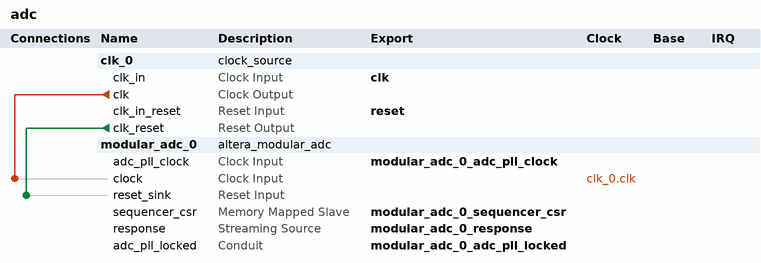
[diagram p0: system contents]
# Platform Designer (Qsys) system adc, MAX 10 10M50DAF484I7G
# Parameters at their usual value, and those the tool derives, are not listed.
package require -exact qsys 17.0
create_system adc
set_project_property DEVICE_FAMILY {MAX 10}
set_project_property DEVICE 10M50DAF484I7G

add_instance clk_0 clock_source 17.0
set_instance_parameter_value clk_0 clockFrequency 50000000
set_instance_parameter_value clk_0 resetSynchronousEdges BOTH

add_instance modular_adc_0 altera_modular_adc 17.0
set_instance_parameter_value modular_adc_0 CLOCK_FREQ 50000000
set_instance_parameter_value modular_adc_0 CORE_VAR 2
set_instance_parameter_value modular_adc_0 DEVICE_PART 10M50DAF484I7G
set_instance_parameter_value modular_adc_0 clkdiv 1
set_instance_parameter_value modular_adc_0 external_vref 2.0
set_instance_parameter_value modular_adc_0 int_vref_vr 3.0
set_instance_parameter_value modular_adc_0 refsel 1
set_instance_parameter_value modular_adc_0 sample_rate 5
set_instance_parameter_value modular_adc_0 seq_order_length 9
set_instance_parameter_value modular_adc_0 seq_order_slot_1 0
set_instance_parameter_value modular_adc_0 seq_order_slot_10 17
set_instance_parameter_value modular_adc_0 seq_order_slot_2 1
set_instance_parameter_value modular_adc_0 seq_order_slot_3 2
set_instance_parameter_value modular_adc_0 seq_order_slot_4 3
set_instance_parameter_value modular_adc_0 seq_order_slot_5 4
set_instance_parameter_value modular_adc_0 seq_order_slot_6 5
set_instance_parameter_value modular_adc_0 seq_order_slot_7 6
set_instance_parameter_value modular_adc_0 seq_order_slot_8 7
set_instance_parameter_value modular_adc_0 seq_order_slot_9 8
set_instance_parameter_value modular_adc_0 use_ch0 true
set_instance_parameter_value modular_adc_0 use_ch2 true
set_instance_parameter_value modular_adc_0 use_ch3 true
set_instance_parameter_value modular_adc_0 use_ch4 true
set_instance_parameter_value modular_adc_0 use_ch5 true
set_instance_parameter_value modular_adc_0 use_ch6 true
set_instance_parameter_value modular_adc_0 use_ch7 true
set_instance_parameter_value modular_adc_0 use_ch8 true
set_instance_parameter_value modular_adc_0 use_tsd true

# connections
add_connection clk_0.clk modular_adc_0.clock clock
add_connection clk_0.clk_reset modular_adc_0.reset_sink reset

# exported interfaces
add_interface clk clock sink
set_interface_property clk EXPORT_OF clk_0.clk_in
add_interface modular_adc_0_adc_pll_clock clock sink
set_interface_property modular_adc_0_adc_pll_clock EXPORT_OF modular_adc_0.adc_pll_clock
add_interface modular_adc_0_adc_pll_locked conduit end
set_interface_property modular_adc_0_adc_pll_locked EXPORT_OF modular_adc_0.adc_pll_locked
add_interface modular_adc_0_response avalon_streaming source
set_interface_property modular_adc_0_response EXPORT_OF modular_adc_0.response
add_interface modular_adc_0_sequencer_csr avalon slave
set_interface_property modular_adc_0_sequencer_csr EXPORT_OF modular_adc_0.sequencer_csr
add_interface reset reset sink
set_interface_property reset EXPORT_OF clk_0.clk_in_reset

set_interconnect_requirement {$system} qsys_mm.clockCrossingAdapter HANDSHAKE
set_interconnect_requirement {$system} qsys_mm.enableEccProtection FALSE
set_interconnect_requirement {$system} qsys_mm.insertDefaultSlave FALSE
set_interconnect_requirement {$system} qsys_mm.maxAdditionalLatency 1

save_system adc.qsys
